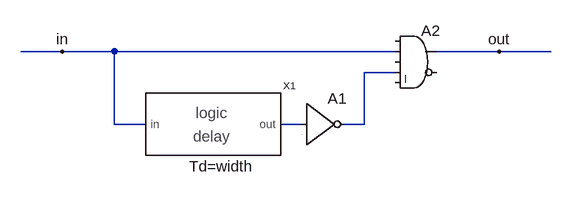
[diagram p0: schematic rising_edge_detect.asc]
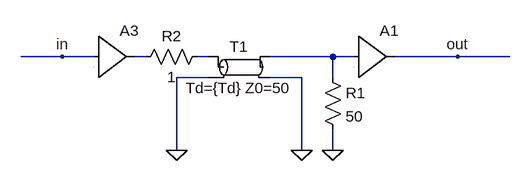
[diagram p1: sub-circuit logic_delay.asc]
rising_edge_detect.asc, the LTspice schematic file:
Version 4
SHEET 1 888 680
WIRE -32 192 -96 192
WIRE 48 192 -32 192
WIRE 480 192 48 192
WIRE 640 192 544 192
WIRE 720 192 640 192
WIRE 480 224 432 224
WIRE 48 304 48 192
WIRE 96 304 48 304
WIRE 336 304 304 304
WIRE 432 304 432 224
WIRE 432 304 400 304
FLAG -32 192 in
FLAG 640 192 out
SYMBOL logic_delay 192 304 R0
SYMATTR SpiceLine Td=width
SYMATTR InstName X1
SYMBOL Digital\\inv 336 240 R0
SYMATTR InstName A1
SYMBOL Digital\\and 512 144 R0
SYMATTR InstName A2

logic_delay.asc, the sub-circuit schematic file:
Version 4
SHEET 1 880 680
WIRE 32 192 -32 192
WIRE 80 192 32 192
WIRE 160 192 144 192
WIRE 256 192 240 192
WIRE 448 192 352 192
WIRE 480 192 448 192
WIRE 640 192 544 192
WIRE 720 192 640 192
WIRE 256 224 208 224
WIRE 400 224 352 224
WIRE 448 224 448 192
WIRE 208 336 208 224
WIRE 400 336 400 224
WIRE 448 336 448 304
FLAG 32 192 in
FLAG 640 192 out
FLAG 400 336 0
FLAG 208 336 0
FLAG 448 336 0
SYMBOL Digital\\buf1 80 128 R0
SYMATTR InstName A3
SYMBOL Digital\\buf1 480 128 R0
SYMATTR InstName A1
SYMBOL res 432 208 R0
SYMATTR InstName R1
SYMATTR Value 50
SYMBOL tline 304 208 R0
SYMATTR InstName T1
SYMATTR Value Td={Td} Z0=50
SYMBOL res 256 176 R90
WINDOW 0 0 56 VBottom 2
WINDOW 3 32 56 VTop 2
SYMATTR InstName R2
SYMATTR Value 1

The netlist it stands for:
* rising_edge_detect.asc
XX1 in N002 logic_delay params: Td=width
A1 N002 0 0 0 0 N001 0 0 BUF
A2 0 in 0 N001 0 0 out 0 AND

* block symbol definitions
.subckt logic_delay in out
A3 in 0 0 0 0 0 N001 0 BUF
A1 N003 0 0 0 0 0 out 0 BUF
R1 N003 0 50
T1 N002 0 N003 0 Td={Td} Z0=50
R2 N002 N001 1
.ends logic_delay

.backanno
.end